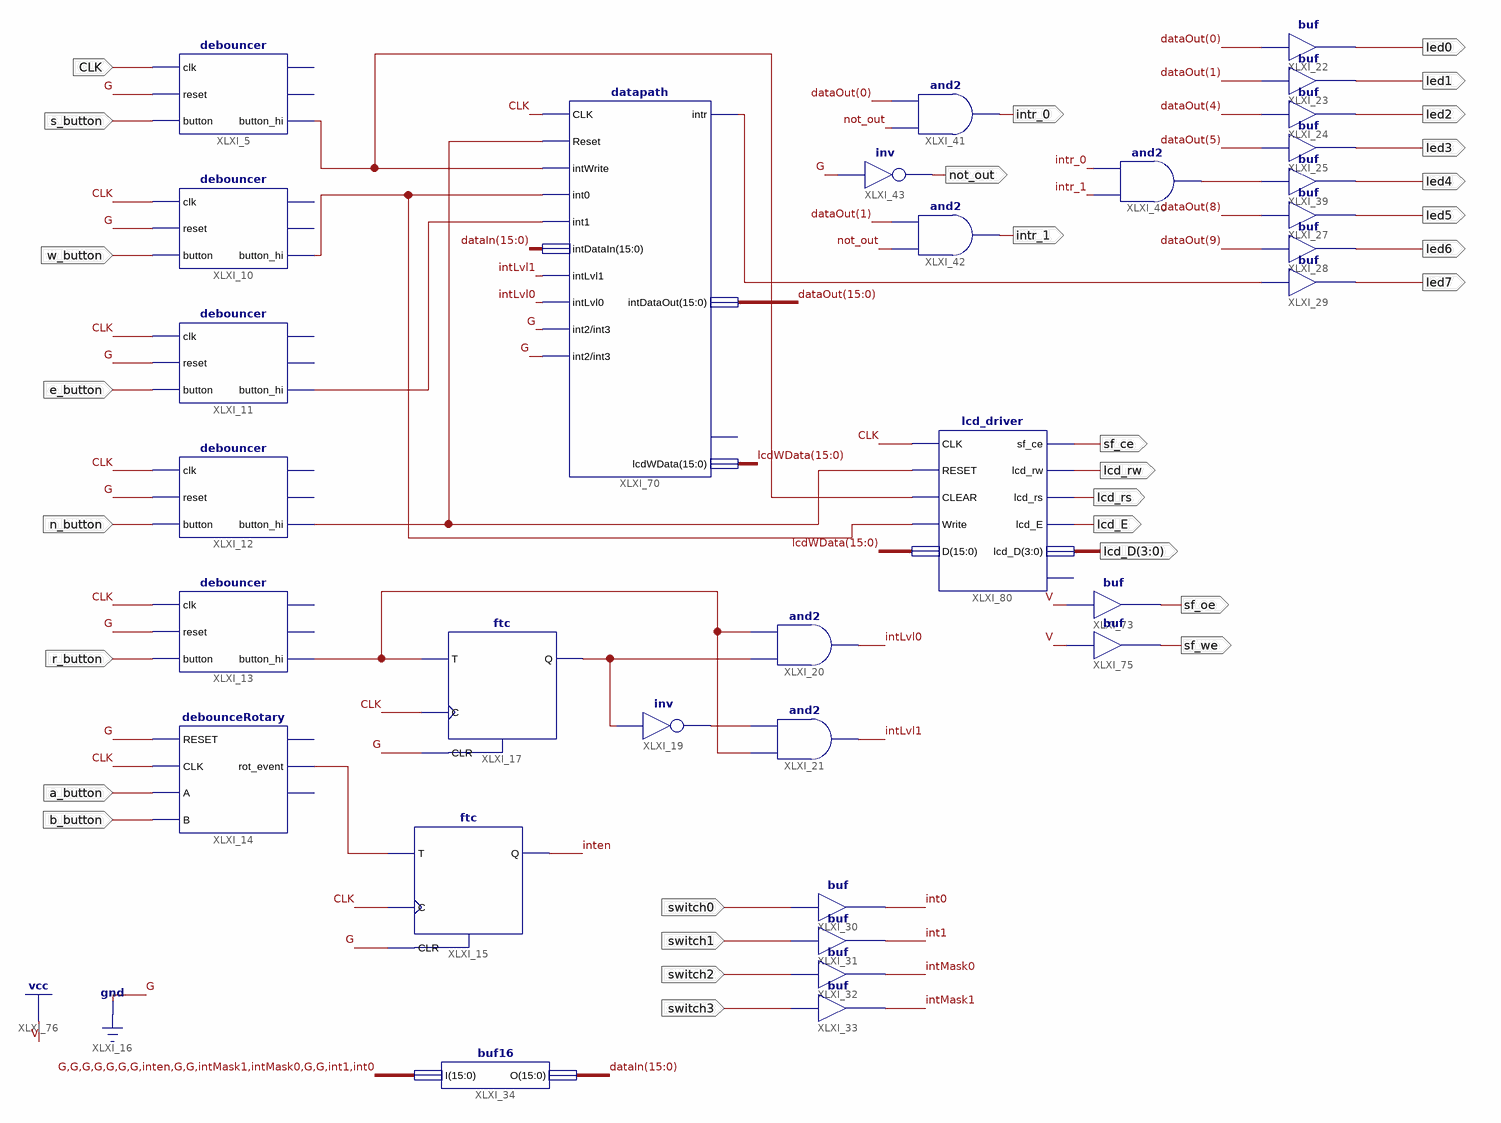
[diagram p0: schematic sheet 1]
// Xilinx ISE schematic IOLevel.sch (spartan3e) as structural Verilog: 32 symbols, 30 ports
module IOLevel (
  input  CLK,
  input  s_button,
  input  w_button,
  input  e_button,
  input  n_button,
  input  r_button,
  input  a_button,
  input  b_button,
  input  switch0,
  input  switch1,
  input  switch2,
  input  switch3,
  output led0,
  output led2,
  output led3,
  output led5,
  output led6,
  output led1,
  output led7,
  output led4,
  output intr_1,
  output intr_0,
  output not_out,
  output sf_oe,
  output sf_we,
  output lcd_E,
  output [3:0] lcd_D,
  output lcd_rw,
  output lcd_rs,
  output sf_ce
);

  wire int0, int1, inten, intLvl0, intLvl1, intMask0, intMask1, XLXN_94, XLXN_95, XLXN_96, XLXN_97, XLXN_109,
       XLXN_110, XLXN_111, XLXN_139, XLXN_170, XLXN_171;
  wire [15:0] dataIn, dataOut, lcdWData;

  debouncer XLXI_5 (.clk(CLK), .reset(1'b0), .button(s_button), .button_hi(XLXN_171));  // open: debutton, button_lo
  debouncer XLXI_10 (.clk(CLK), .reset(1'b0), .button(w_button), .button_hi(XLXN_95));  // open: debutton, button_lo
  debouncer XLXI_11 (.clk(CLK), .reset(1'b0), .button(e_button), .button_hi(XLXN_96));  // open: debutton, button_lo
  debouncer XLXI_12 (.clk(CLK), .reset(1'b0), .button(n_button), .button_hi(XLXN_94));  // open: debutton, button_lo
  debouncer XLXI_13 (.clk(CLK), .reset(1'b0), .button(r_button), .button_hi(XLXN_111));  // open: debutton, button_lo
  debounceRotary XLXI_14 (
    .A(a_button), .B(b_button), .CLK(CLK), .RESET(1'b0), .rot_event(XLXN_97));  // open: rot_event_delay, rot_left
  ftc XLXI_17 (.C(CLK), .CLR(1'b0), .T(XLXN_111), .Q(XLXN_109));
  ftc XLXI_15 (.C(CLK), .CLR(1'b0), .T(XLXN_97), .Q(inten));
  not XLXI_19 (XLXN_110, XLXN_109);
  and XLXI_20 (intLvl0, XLXN_109, XLXN_111);
  and XLXI_21 (intLvl1, XLXN_111, XLXN_110);
  buf16 XLXI_34 (.I({{7{1'b0}}, inten, 2'b00, intMask1, intMask0, 2'b00, int1, int0}), .O(dataIn));
  buf XLXI_30 (int0, switch0);
  buf XLXI_31 (int1, switch1);
  buf XLXI_32 (intMask0, switch2);
  buf XLXI_33 (intMask1, switch3);
  datapath XLXI_70 (
    .CLK(CLK), .Reset(XLXN_94), .intWrite(XLXN_171), .int0(XLXN_95), .int1(XLXN_96), .int2(1'b0),
    .int3(1'b0), .intDataIn(dataIn), .intLvl1(intLvl1), .intLvl0(intLvl0), .lcdWData(lcdWData),
    .intr(XLXN_139), .intDataOut(dataOut));  // open: syscallW
  buf XLXI_22 (led0, dataOut[0]);
  buf XLXI_23 (led1, dataOut[1]);
  buf XLXI_25 (led3, dataOut[5]);
  buf XLXI_27 (led5, dataOut[8]);
  buf XLXI_28 (led6, dataOut[9]);
  buf XLXI_29 (led7, XLXN_139);
  buf XLXI_24 (led2, dataOut[4]);
  buf XLXI_39 (led4, XLXN_170);
  and XLXI_40 (XLXN_170, intr_1, intr_0);
  and XLXI_42 (intr_1, not_out, dataOut[1]);
  not XLXI_43 (not_out, 1'b0);
  and XLXI_41 (intr_0, not_out, dataOut[0]);
  buf XLXI_73 (sf_oe, 1'b1);
  buf XLXI_75 (sf_we, 1'b1);
  lcd_driver XLXI_80 (
    .CLK(CLK), .RESET(XLXN_94), .CLEAR(XLXN_171), .Write(XLXN_95), .D(lcdWData), .lcd_E(lcd_E),
    .lcd_rs(lcd_rs), .lcd_D(lcd_D), .sf_ce(sf_ce), .lcd_rw(lcd_rw));  // open: lcdReady
endmodule
